# Altium project Prog.PrjPcb
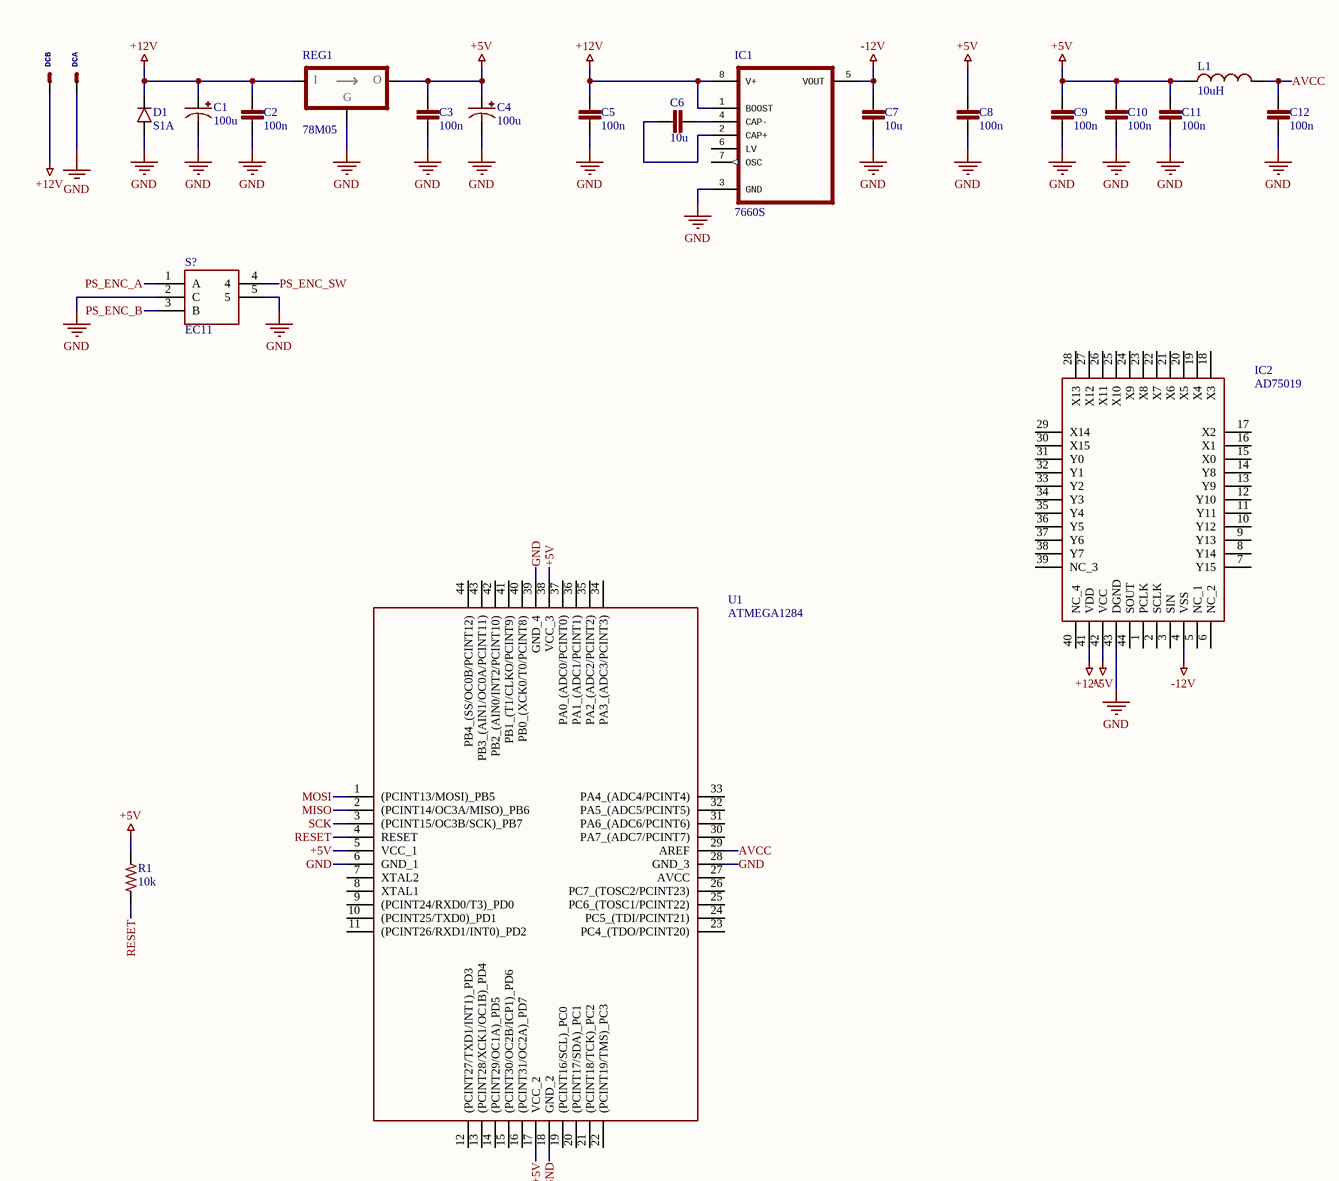
[diagram p0: Prog.SchDoc]
1 sheet, 21 parts. Net scope: global (net labels, ports and power ports of the same name join across sheets).
Board file: Prog.PcbDoc

## Sheet Prog.SchDoc
size B

### Parts
C1  100u  [CAPAE_D]
C2  100n  [CHIP_0603]
C3  100n  [CHIP_0603]
C4  100u  [CAPAE_D]
C5  100n  [CHIP_0603]
C6  10u  [CHIP_1206]
C7  10u  [CHIP_1206]
C8  100n  [CHIP_0603]
C9  100n  [CHIP_0603]
C10  100n  [CHIP_0603]
C11  100n  [CHIP_0603]
C12  100n  [CHIP_0603]
D1  S1A  [DO214]
DC  J_JST-XH-02  [JST-XH-02]  (value not drawn)  (parts A,B of 2)
IC1  7660S  [SO8]
IC2  AD75019  [PLCC-44]
L1  10uH  [INDC1608X10]
R1  10k  [CHIP_R_0603]
REG1  78M05  [SOT223]
S?  EC11  [ALPHA_EC11]
U1  ATMEGA1284  [TQFP44]

### Nets
+5V: C3.1 C4.+ C8.1 C9.1 C10.1 C11.1 IC2.42(VCC) L1.2 R1.1 REG1.1(OUTPUT) U1.5(VCC_1) U1.17(VCC_2) U1.38(VCC_3)
+12V: C1.+ C2.1 C5.1 D1.1 DC.1(S) IC1.1(BOOST) IC1.8(V+) IC2.41(VDD) REG1.2(INPUT)
-12V: C7.1 IC1.5(VOUT) IC2.4(VSS)
GND: C1.- C2.2 C3.2 C4.- C5.2 C7.2 C8.2 C9.2 C10.2 C11.2 C12.2 D1.2 DC.2(S) IC1.3(GND) IC2.43(DGND) REG1.3(COMMON) S?.2(C) S?.5 U1.6(GND_1) U1.18(GND_2) U1.28(GND_3) U1.39(GND_4)
AVCC: C12.1 L1.1 U1.29(AREF)
MISO: U1.2((PCINT14/OC3A/MISO)_PB6)
MOSI: U1.1((PCINT13/MOSI)_PB5)
PS_ENC_A: S?.1(A)
PS_ENC_B: S?.3(B)
PS_ENC_SW: S?.4
RESET: R1.2 U1.4(RESET)
SCK: U1.3((PCINT15/OC3B/SCK)_PB7)
NetC6_1: C6.1 IC1.2(CAP+)
NetC6_2: C6.2 IC1.4(CAP-)

Not connected (* = marked no-connect by the designer): IC1 6(LV) 7(OSC); IC2 1(PCLK) 2(SCLK) 3(SIN) 5(NC_1) 6(NC_2) 7(Y15) 8(Y14) 9(Y13) 10(Y12) 11(Y11) 12(Y10) 13(Y9) 14(Y8) 15(X0) 16(X1) 17(X2) 18(X3) 19(X4) 20(X5) 21(X6) 22(X7) 23(X8) 24(X9) 25(X10) 26(X11) 27(X12) 28(X13) 29(X14) 30(X15) 31(Y0) 32(Y1) 33(Y2) 34(Y3) 35(Y4) 36(Y5) 37(Y6) 38(Y7) 39(NC_3) 40(NC_4) 44(SOUT); U1 7(XTAL2) 8(XTAL1) 9((PCINT24/RXD0/T3)_PD0) 10((PCINT25/TXD0)_PD1) 11((PCINT26/RXD1/INT0)_PD2) 12((PCINT27/TXD1/INT1)_PD3) 13((PCINT28/XCK1/OC1B)_PD4) 14((PCINT29/OC1A)_PD5) 15((PCINT30/OC2B/ICP1)_PD6) 16((PCINT31/OC2A)_PD7) 19((PCINT16/SCL)_PC0) 20((PCINT17/SDA)_PC1) 21((PCINT18/TCK)_PC2) 22((PCINT19/TMS)_PC3) 23(PC4_(TDO/PCINT20)) 24(PC5_(TDI/PCINT21)) 25(PC6_(TOSC1/PCINT22)) 26(PC7_(TOSC2/PCINT23)) 27(AVCC) 30(PA7_(ADC7/PCINT7)) 31(PA6_(ADC6/PCINT6)) 32(PA5_(ADC5/PCINT5)) 33(PA4_(ADC4/PCINT4)) 34(PA3_(ADC3/PCINT3)) 35(PA2_(ADC2/PCINT2)) 36(PA1_(ADC1/PCINT1)) 37(PA0_(ADC0/PCINT0)) 40(PB0_(XCK0/T0/PCINT8)) 41(PB1_(T1/CLKO/PCINT9)) 42(PB2_(AIN0/INT2/PCINT10)) 43(PB3_(AIN1/OC0A/PCINT11)) 44(PB4_(SS/OC0B/PCINT12))

### Notes on the sheet
- (in symbol UA78M05CDCY) I; O; G

### Library data of the parts
C1 C4 = MCVVT025M101EA6L: CAP ALUM 100UF 25V SMD; Manufacturer: Multicomp; Life (Hours): 2000Hour; Ripple Current (AC): 6.3mA; Supplier 1: Farnell; Supplier Part Number 1: 2611370; Manufacturer Part Number: MCVVT025M101EA6L; Stock: 1063; Pricing: 1=0.157, 50=0.104, 100=0.0932, 250=0.0801, 500=0.0681 (EUR); RoHS: No; Min Operating Temperature: -55°C; Max Operating Temperature: 105°C; Capacitance: 100uF; Voltage Rating: 25V; Packaging: Tape and Reel; Voltage Rating (DC): 25V; Diameter: 6.3mm; Height: 7.7mm; REACH SVHC: No SVHC; ComponentLink1URL: http://www.farnell.com/datasheets/2151198.pdf?src-supplier=Element14; ComponentLink1Description: http://www.farnell.com/datasheets/2151198.pdf?src-supplier=Element14; Price: 0.102
C2 C3 C5 C8-C12 = MC0603B104K500CT: CAP CER 100NF 50V X7R 0603; Manufacturer: Multicomp; Tolerance: 10%; Supplier 1: Farnell; Supplier Part Number 1: 1759122; Manufacturer Part Number: MC0603B104K500CT; Stock 1: 1057763; RoHS: Yes; Case/Package: 0603; Number of Pins: 2; Case Code (Metric): 1608; Case Code (Imperial): 0603; Min Operating Temperature: -55°C; Max Operating Temperature: 125°C; Packaging: Cut Tape; Voltage Rating: 50V; Capacitance: 100nF; Dielectric: X7R; Voltage Rating (DC): 50V; REACH SVHC: Unknown; ComponentLink1URL: https://datasheet.ciiva.com/22686/1901289-22686278.pdf?src-supplier=Element14; ComponentLink1Description: https://datasheet.ciiva.com/22686/1901289-22686278.pdf?src-supplier=Element14; ComponentLink2URL: https://datasheet.ciiva.com/22686/1901289-22686279.pdf?src-supplier=Element14; ComponentLink2Description: https://datasheet.ciiva.com/22686/1901289-22686279.pdf?src-supplier=Element14; ComponentLink3URL: https://datasheet.ciiva.com/22648/1901289-22648411.pdf?src-supplier=Element14; ComponentLink3Description: https://datasheet.ciiva.com/22648/1901289-22648411.pdf?src-supplier=Element14; Price: 0.0458
C6 C7 = TMK316B7106KL-TD: CAP CER 10uF 25V X7R 1206; Manufacturer: Taiyo Yuden; Tolerance: 10%; Supplier 1: Farnell; Supplier Part Number 1: 2113073; Manufacturer Part Number: TMK316B7106KL-TD; RoHS: Yes; Category: Ceramic Capacitors; Stock: 588931; Mount: Surface Mount; Case/Package: 1206; Number of Pins: 2; Case Code (Imperial): 1206; Case Code (Metric): 3216; Weight: 0.000571oz; Min Operating Temperature: -55°C; Max Operating Temperature: 125°C; Capacitance: 10uF; Voltage Rating: 25V; Packaging: Tape and Reel; Dielectric: X7R; Voltage Rating (DC): 25V; Package Quantity: 1; Termination: SMD/SMT; Resistor Type: Ceramic; Length: 0.126inch; Width: 1.6mm; Height: 1.6mm; Thickness: 0.071inch; REACH SVHC: Unknown; ComponentLink1URL: https://datasheet.ciiva.com/15922/582tmk316ab7106kl-t-15922403.pdf?src-supplier=Onlinecomponents.com; ComponentLink1Description: https://datasheet.ciiva.com/15922/582tmk316ab7106kl-t-15922403.pdf?src-supplier=Onlinecomponents.com; ComponentLink2URL: https://datasheet.ciiva.com/7975/1784422-7975593.pdf?src-supplier=Element14; ComponentLink2Description: https://datasheet.ciiva.com/7975/1784422-7975593.pdf?src-supplier=Element14; ComponentLink3URL: https://datasheet.ciiva.com/30123/25tmk316ab7106kl-t-30123726.pdf?src-supplier=Onlinecomponents.com; ComponentLink3Description: https://datasheet.ciiva.com/30123/25tmk316ab7106kl-t-30123726.pdf?src-supplier=Onlinecomponents.com; ComponentLink4URL: https://datasheet.ciiva.com/7975/mlcc-all-e-7975834.pdf?src-supplier=Element14; ComponentLink4Description: https://datasheet.ciiva.com/7975/mlcc-all-e-7975834.pdf?src-supplier=Element14; ComponentLink5URL: https://datasheet.ciiva.com/139/mlcc-all-e-139531.pdf?src-supplier=Digi-Key; ComponentLink5Description: https://datasheet.ciiva.com/139/mlcc-all-e-139531.pdf?src-supplier=Digi-Key; ComponentLink6URL: https://datasheet.ciiva.com/22748/1481447-22748971.pdf?src-supplier=Element14; ComponentLink6Description: https://datasheet.ciiva.com/22748/1481447-22748971.pdf?src-supplier=Element14; ComponentLink7URL: https://datasheet.ciiva.com/139/mlcc-all-e-139532.pdf?src-supplier=Digi-Key; ComponentLink7Description: https://datasheet.ciiva.com/139/mlcc-all-e-139532.pdf?src-supplier=Digi-Key; ComponentLink8URL: https://datasheet.ciiva.com/139/mlcc-all-e-139533.pdf?src-supplier=Digi-Key; ComponentLink8Description: https://datasheet.ciiva.com/139/mlcc-all-e-139533.pdf?src-supplier=Digi-Key; Price: 0.149
D1 = S1A: DIODE GEN PURP 50V 1A SMA; Manufacturer: ON Semiconductor / Fairchild; Peak Reverse Current: 1uA; Max Surge Current: 40A; Forward Voltage: 1.1V; Peak Non-Repetitive Surge Current: 30A; Element Configuration: Single; Capacitance: 12pF; Recovery Time: 1800ns; Reverse Recovery Time: 1.8us; Polarity: Standard; Power Dissipation: 1.4W; Supplier 1: Farnell; Supplier Part Number 1: 9843868; Manufacturer Part Number: S1A; Stock: 34555; Pricing: 5=0.184, 25=0.179, 100=0.0727, 250=0.0669, 500=0.0667, 1000=0.0364, 5000=0.0293 (EUR); RoHS: Yes; Mount: Surface Mount; Case/Package: SMA; Number of Pins: 2; Weight: 0.106g; Contact Plating: Tin; Min Operating Temperature: -55°C; Max Operating Temperature: 150°C; Packaging: Tape and Reel; Package Quantity: 1; Voltage Rating (DC): 50V; Current Rating: 1A; Output Current: 1A; Forward Current: 1A; Max Repetitive Reverse Voltage (Vrrm): 50V; Average Rectified Current: 1A; Max Forward Surge Current (Ifsm): 30A; Max Reverse Voltage (DC): 50V; Reverse Voltage: 50V; Width: 5.28mm; Radiation Hardening: No; REACH SVHC: No SVHC; Lead Free: Lead Free; ComponentLink1URL: https://datasheet.ciiva.com/910/s1a-910480.pdf?src-supplier=Avnet; ComponentLink1Description: https://datasheet.ciiva.com/910/s1a-910480.pdf?src-supplier=Avnet; ComponentLink2URL: https://datasheet.ciiva.com/23683/1730038-23683616.pdf?src-supplier=Newark; ComponentLink2Description: https://datasheet.ciiva.com/23683/1730038-23683616.pdf?src-supplier=Newark; ComponentLink3URL: https://datasheet.ciiva.com/4452/s1a-191336-4452662.pdf?src-supplier=Mouser; ComponentLink3Description: https://datasheet.ciiva.com/4452/s1a-191336-4452662.pdf?src-supplier=Mouser; ComponentLink4URL: https://datasheet.ciiva.com/25624/0900766b80f9b629-25624903.pdf?src-supplier=RSComponents; ComponentLink4Description: https://datasheet.ciiva.com/25624/0900766b80f9b629-25624903.pdf?src-supplier=RSComponents; ComponentLink5URL: https://datasheet.ciiva.com/916/s1a-916898.pdf?src-supplier=Digi-Key; ComponentLink5Description: https://datasheet.ciiva.com/916/s1a-916898.pdf?src-supplier=Digi-Key; ComponentLink6URL: https://datasheet.ciiva.com/916/s1a-916899.pdf?src-supplier=Digi-Key; ComponentLink6Description: https://datasheet.ciiva.com/916/s1a-916899.pdf?src-supplier=Digi-Key; ComponentLink7URL: https://datasheet.ciiva.com/916/s1a-916900.pdf?src-supplier=Digi-Key; ComponentLink7Description: https://datasheet.ciiva.com/916/s1a-916900.pdf?src-supplier=Digi-Key; ComponentLink8URL: https://datasheet.ciiva.com/16800/s1a-16800103.pdf?src-supplier=Future+Electronics; ComponentLink8Description: https://datasheet.ciiva.com/16800/s1a-16800103.pdf?src-supplier=Future+Electronics; ComponentLink9URL: https://datasheet.ciiva.com/28469/1766308-28469031.pdf?src-supplier=Element14; ComponentLink9Description: https://datasheet.ciiva.com/28469/1766308-28469031.pdf?src-supplier=Element14; ComponentLink10URL: https://datasheet.ciiva.com/26231/s1k-26231832.pdf?src-supplier=Avnet+Europe; ComponentLink10Description: https://datasheet.ciiva.com/26231/s1k-26231832.pdf?src-supplier=Avnet+Europe; ComponentLink11URL: https://datasheet.ciiva.com/16474/s1k-16474283.pdf?src-supplier=Avnet+Asia; ComponentLink11Description: https://datasheet.ciiva.com/16474/s1k-16474283.pdf?src-supplier=Avnet+Asia; Price: 0.072
DC = J_JST-XH-02: 2 Pins male XH header; Price: 0.1
IC1 = ICL7660SCBAZ: RENESAS - ICL7660SCBAZ - IC DC DC CHARGE PUMP; Manufacturer: Intersil; Output Voltage: 22.8V; Logic Function: Inverting; Output Current: 45mA; Number of Outputs: 1; Max Input Voltage: 12V; Min Supply Voltage: 1.5V; Switching Frequency: 10kHz; Synchronous Rectifier: No; Min Output Voltage: -12V; Max Output Voltage: -1.5V; Max Supply Current: 180uA; Topology: Boost; Output Type: Adjustable; Supplier 1: Farnell; Supplier Part Number 1: 1561969; Manufacturer Part Number: ICL7660SCBAZ; Stock: 4037; Pricing: 1=1.19, 25=1.01, 50=0.911, 100=0.804, 250=0.745, 500=0.686, 1000=0.672, 2500=0.664 (EUR); RoHS: Yes; Mount: Surface Mount; Case/Package: SOIC; Number of Pins: 8; Weight: 0.019048oz; Contact Plating: Tin; Min Operating Temperature: 0°C; Max Operating Temperature: 70°C; Packaging: Rail/Tube; Max Supply Voltage: 12V; Package Quantity: 98; Max Output Current: 45mA; Min Input Voltage: 1.5V; Length: 5mm; Height: 1.5mm; Width: 4mm; Radiation Hardening: No; Lead Free: Lead Free; REACH SVHC: No SVHC; ComponentLink1URL: https://datasheet.ciiva.com/26896/icl7660scbaz-26896984.pdf?src-supplier=IIIC; ComponentLink1Description: https://datasheet.ciiva.com/26896/icl7660scbaz-26896984.pdf?src-supplier=IIIC; ComponentLink2URL: https://datasheet.ciiva.com/2027/icl7660s-a-2027389.pdf?src-supplier=Digi-Key; ComponentLink2Description: https://datasheet.ciiva.com/2027/icl7660s-a-2027389.pdf?src-supplier=Digi-Key; Price: 1.52
IC2 = AD75019JPZ: Analog & Digital Crosspoint ICs 256 Analog Switches in 16x16 Array; Manufacturer: Analog Devices; On-State Resistance: 500R; Max Supply Voltage: 5.5V; Min Supply Voltage: 4.5V; Bandwidth: 20MHz; Operating Supply Current: 800uA; Supply Type: Single,Dual,Triple; Max Output Voltage: 11.5V; Nominal Supply Current: 1.5mA; Supplier 1: Mouser; Manufacturer Part Number: AD75019JPZ; RoHS: Yes; Category: Interface ICs; Stock 1: 290; Pricing 1: 1=37.61000, 5=36.05000, 10=34.69000, 25=33.12000, 50=31.18000, 100=28.25000 (USD); Case/Package: PLCC; Number of Pins: 44; Weight: 0.084185oz; Min Operating Temperature: -25°C; Max Operating Temperature: 85°C; Package Quantity: 27; Packaging: Rail/Tube; Max Dual Supply Voltage: 5.5V; Min Dual Supply Voltage: 4.5V; Length: 16.66mm; Width: 16.66mm; Height: 3.68mm; Radiation Hardening: No; Lead Free: Contains Lead; REACH SVHC: No SVHC; ComponentLink1URL: https://datasheet.ciiva.com/1170/66420-1170438.pdf?src-supplier=Element14; ComponentLink1Description: https://datasheet.ciiva.com/1170/66420-1170438.pdf?src-supplier=Element14; ComponentLink2URL: https://datasheet.ciiva.com/26824/ad75019jpz-26824058.pdf?src-supplier=IIIC; ComponentLink2Description: https://datasheet.ciiva.com/26824/ad75019jpz-26824058.pdf?src-supplier=IIIC; ComponentLink3URL: https://datasheet.ciiva.com/3036/ad75019-3036466.pdf?src-supplier=Avnet; ComponentLink3Description: https://datasheet.ciiva.com/3036/ad75019-3036466.pdf?src-supplier=Avnet; Price: 31.86
L1 = MLZ1608N100LT: TDK         MLZ1608N100LT             Surface Mount Power Inductor, Ferrite, MLZ Series, 10 H, 300 mA, 60 mA, Multilayer, 0.6 ohm                          New; Tolerance: 20%; Shielding: Shielded; DC Resistance (DCR): 780mR; Test Frequency: 2MHz; Self Resonant Frequency: 50MHz; Saturation Current: 60mA; DC Current: 300mA; Supplier 1: Farnell; Supplier Part Number 1: 2564062; Manufacturer: TDK; Manufacturer Part Number: MLZ1608N100LT; RoHS: Yes; Category: Inductors; Stock: 14993; Pricing: 10=0.12200, 100=0.07240, 500=0.06400, 1000=0.05560, 2000=0.04660, 4000=0.03890, 20000=0.03730 (EUR); Mount: Surface Mount; Case/Package: 603; Core Material: Ferrite; Min Operating Temperature: -55°C; Max Operating Temperature: 125°C; Packaging: Cut Tape; Inductance: 10uH; Inductance Tolerance: 20%; Military Standard: Not; RMS Current (Irms): 300mA; Length: 1.75mm; Depth: 0.95mm; REACH SVHC: No SVHC; ComponentLink1URL: http://www.farnell.com/datasheets/2053102.pdf?src-supplier=Farnell; ComponentLink1Description: http://www.farnell.com/datasheets/2053102.pdf?src-supplier=Farnell; ComponentLink2URL: http://components.arrow.com/part/dataview/0323_03824957?src-supplier=Arrow+Europe; ComponentLink2Description: http://components.arrow.com/part/dataview/0323_03824957?src-supplier=Arrow+Europe; ComponentLink3URL: http://www.farnell.com/datasheets/2053102.pdf?src-supplier=Element14; ComponentLink3Description: http://www.farnell.com/datasheets/2053102.pdf?src-supplier=Element14; Price: 0.077
R1 = CRCW060310K0FKEA: RES SMD 10K OHM 1% 1/10W 0603; Manufacturer: Vishay; Resistance: 10kR; Temperature Coefficient: 100ppm/°C; Power Rating: 100mW; Voltage Rating: 75V; Supplier 1: Farnell; Supplier Part Number 1: 1469748; Manufacturer Part Number: CRCW060310K0FKEA; Stock: 1391124; Pricing: 10=0.0169, 100=0.013, 500=0.0113, 1000=0.008 (EUR); RoHS: Yes; Case/Package: 0603; Number of Pins: 2; Weight: 7.1E-05oz; Contact Plating: Tin; Case Code (Metric): 1608; Case Code (Imperial): 0603; Min Operating Temperature: -55°C; Max Operating Temperature: 155°C; Tolerance: 1%; Composition: Thick Film; Packaging: Tape and Reel; Package Quantity: 10; Number of Terminations: 2; Military Standard: Not; Termination: SMD/SMT; Max Power Dissipation: 100mW; Voltage Rating (DC): 75V; Features: Automotive AEC-Q200; Length: 1.55mm; Height: 0.45mm; Width: 0.033inch; Depth: 0.85mm; Radiation Hardening: No; Lead Free: Lead Free; REACH SVHC: Unknown; ComponentLink1URL: https://datasheet.ciiva.com/11809/0900766b80d98afc-11809037.pdf?src-supplier=RSComponents; ComponentLink1Description: https://datasheet.ciiva.com/11809/0900766b80d98afc-11809037.pdf?src-supplier=RSComponents; ComponentLink2URL: https://datasheet.ciiva.com/16886/dcrcw-16886037.pdf?src-supplier=Avnet+Europe; ComponentLink2Description: https://datasheet.ciiva.com/16886/dcrcw-16886037.pdf?src-supplier=Avnet+Europe; ComponentLink3URL: https://datasheet.ciiva.com/26821/getdatasheetpartid-86831-26821109.pdf?src-supplier=Verical; ComponentLink3Description: https://datasheet.ciiva.com/26821/getdatasheetpartid-86831-26821109.pdf?src-supplier=Verical; ComponentLink4URL: https://datasheet.ciiva.com/16754/70201119-16754710.pdf?src-supplier=Allied+Electronics; ComponentLink4Description: https://datasheet.ciiva.com/16754/70201119-16754710.pdf?src-supplier=Allied+Electronics; ComponentLink5URL: https://datasheet.ciiva.com/16719/70201119-16719704.pdf?src-supplier=Allied+Electronics; ComponentLink5Description: https://datasheet.ciiva.com/16719/70201119-16719704.pdf?src-supplier=Allied+Electronics; ComponentLink6URL: https://datasheet.ciiva.com/2465/dcrcwe3-2465513.pdf?src-supplier=Digi-Key; ComponentLink6Description: https://datasheet.ciiva.com/2465/dcrcwe3-2465513.pdf?src-supplier=Digi-Key; ComponentLink7URL: https://datasheet.ciiva.com/5543/dcrcwe3-109170-5543001.pdf?src-supplier=Mouser; ComponentLink7Description: https://datasheet.ciiva.com/5543/dcrcwe3-109170-5543001.pdf?src-supplier=Mouser; ComponentLink8URL: https://datasheet.ciiva.com/2465/dcrcwe3-2465514.pdf?src-supplier=Digi-Key; ComponentLink8Description: https://datasheet.ciiva.com/2465/dcrcwe3-2465514.pdf?src-supplier=Digi-Key; ComponentLink9URL: https://datasheet.ciiva.com/46385/1697337-46385498.pdf?src-supplier=Element14; ComponentLink9Description: https://datasheet.ciiva.com/46385/1697337-46385498.pdf?src-supplier=Element14; ComponentLink10URL: https://datasheet.ciiva.com/2465/dcrcwe3-2465515.pdf?src-supplier=Digi-Key; ComponentLink10Description: https://datasheet.ciiva.com/2465/dcrcwe3-2465515.pdf?src-supplier=Digi-Key; ComponentLink11URL: https://datasheet.ciiva.com/3256/dcrcwe3-3256939.pdf?src-supplier=Avnet; ComponentLink11Description: https://datasheet.ciiva.com/3256/dcrcwe3-3256939.pdf?src-supplier=Avnet; ComponentLink12URL: https://datasheet.ciiva.com/3256/dcrcwe3-3256940.pdf?src-supplier=Avnet; ComponentLink12Description: https://datasheet.ciiva.com/3256/dcrcwe3-3256940.pdf?src-supplier=Avnet; ComponentLink13URL: https://datasheet.ciiva.com/16209/dcrcwe3-16209164.pdf?src-supplier=Future+Electronics; ComponentLink13Description: https://datasheet.ciiva.com/16209/dcrcwe3-16209164.pdf?src-supplier=Future+Electronics; ComponentLink14URL: https://datasheet.ciiva.com/26314/fld-crcw-e3-data-en-26314749.pdf?src-supplier=Distrelec; ComponentLink14Description: https://datasheet.ciiva.com/26314/fld-crcw-e3-data-en-26314749.pdf?src-supplier=Distrelec; Price: 0.0131
REG1 = UA78M05CDCY: IC REG LINEAR 5V 500MA SOT223-4; Manufacturer: Texas Instruments; Max Input Voltage: 25V; Min Input Voltage: 7V; Number of Outputs: 1; Dropout Voltage: 2V; Polarity: Positive; Power Supply Rejection Ratio (PSRR): 80dB; Quiescent Current: 4.5mA; Output Type: Fixed; Min Output Voltage: 4.75V; Supplier 1: Farnell; Supplier Part Number 1: 2296030; Manufacturer Part Number: UA78M05CDCY; Stock: 6366; Pricing: 1=0.51, 50=0.445, 100=0.288, 250=0.262, 500=0.236, 1000=0.21, 2500=0.199, 5000=0.188 (EUR); RoHS: Yes; Mount: Surface Mount; Case/Package: SOT-223; Number of Pins: 4; Weight: 0.006632oz; Contact Plating: Tin; Min Operating Temperature: -40°C; Max Operating Temperature: 125°C; Output Voltage: 5V; Output Current: 500mA; Packaging: Rail/Tube; Package Quantity: 80; Max Output Current: 500mA; Number of Regulators: 1; Nominal Output Voltage: 5V; Max Output Voltage: 5V; Length: 6.5mm; Height: 1.6mm; Width: 3.5mm; Radiation Hardening: No; Lead Free: Lead Free; REACH SVHC: No SVHC; ComponentLink1URL: https://datasheet.ciiva.com/7992/1831162-7992581.pdf?src-supplier=Element14; ComponentLink1Description: https://datasheet.ciiva.com/7992/1831162-7992581.pdf?src-supplier=Element14; ComponentLink2URL: https://datasheet.ciiva.com/3224/ua78m05-3224613.pdf?src-supplier=Avnet; ComponentLink2Description: https://datasheet.ciiva.com/3224/ua78m05-3224613.pdf?src-supplier=Avnet; ComponentLink3URL: https://datasheet.ciiva.com/16490/ua78m12-16490200.pdf?src-supplier=Avnet+Asia; ComponentLink3Description: https://datasheet.ciiva.com/16490/ua78m12-16490200.pdf?src-supplier=Avnet+Asia; ComponentLink4URL: https://datasheet.ciiva.com/22629/1882046-22629338.pdf?src-supplier=Element14; ComponentLink4Description: https://datasheet.ciiva.com/22629/1882046-22629338.pdf?src-supplier=Element14; ComponentLink5URL: https://datasheet.ciiva.com/5697/ua78m08-5697147.pdf?src-supplier=Farnell; ComponentLink5Description: https://datasheet.ciiva.com/5697/ua78m08-5697147.pdf?src-supplier=Farnell; ComponentLink6URL: https://datasheet.ciiva.com/26255/ua78m12-26255901.pdf?src-supplier=Avnet+Europe; ComponentLink6Description: https://datasheet.ciiva.com/26255/ua78m12-26255901.pdf?src-supplier=Avnet+Europe; ComponentLink7URL: https://datasheet.ciiva.com/2060/ua78m05-2060143.pdf?src-supplier=Digi-Key; ComponentLink7Description: https://datasheet.ciiva.com/2060/ua78m05-2060143.pdf?src-supplier=Digi-Key
S? = ENC_EC11
U1 = ATMEGA1284-AU: Integrated Circuit; Manufacturer_Name: Microchip; Datasheet Link: http://ww1.microchip.com/downloads/en/devicedoc/atmel-42718-atmega1284_datasheet_summary.pdf; Height: 1.2mm; Manufacturer_Part_Number: ATMEGA1284-AU; Price: 4.5